# Altium schematic sheet ESP8266_ClockLed.SchDoc
size A4; SheetNumber: 5; SheetTotal: 8
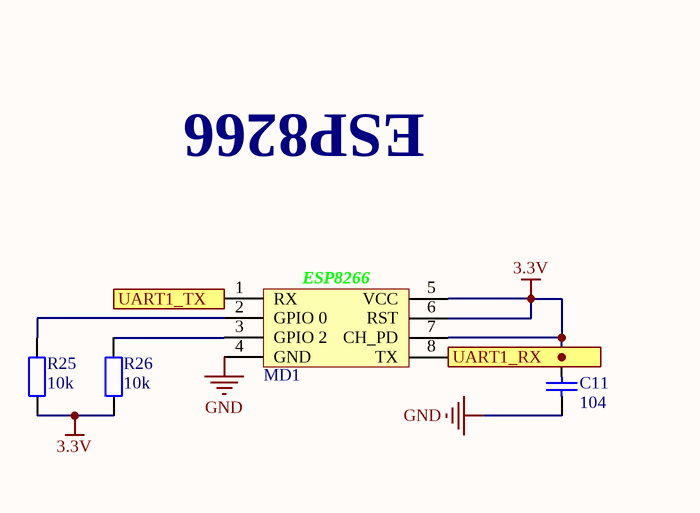
[diagram p0: ESP8266_ClockLed.SchDoc]

## Parts
C11  104  [tu 0805]
MD1  ESP8266 Module  [ESP2866 Module]  (value not drawn)
R25  10k  [tro smd 0805]
R26  10k  [tro smd 0805]

## Ports
UART1_RX, UART1_TX

## Nets
3.3V: C11.2 MD1.5(VCC) MD1.6(RST) MD1.7(CH_PD) R25.1 R26.1
GND: C11.1 MD1.4(GND)
UART1_RX: MD1.8(TX) ; port UART1_RX
UART1_TX: MD1.1(RX) ; port UART1_TX
NetMD1_2: MD1.2(GPIO_0) R25.2
NetMD1_3: MD1.3(GPIO_2) R26.2

## Notes on the sheet
- ESP8266
- (in symbol ESP8266 Module) ESP8266

## Library data of the parts
C11 = Tu 0805 104 50V 10%: Dán; Don_Vi: Con; So_Chan: 2; Ten_Linh_Kien: Tụ 0805 104-100nF 10% 50V; Ma_Hang: MH004551; Chung_Loai: Dán; Kieu_Chan: *
R25 R26 = Tro 0805 5% 10k: Dán; Don_Vi: Con; So_Chan: 2; Ten_Linh_Kien: Trở 0805 5% 10k; Ma_Hang: MH005239; Chung_Loai: Dán; Kieu_Chan: *